# Altium schematic sheet Display.SchDoc
size A4; SheetNumber: 7; SheetTotal: 7
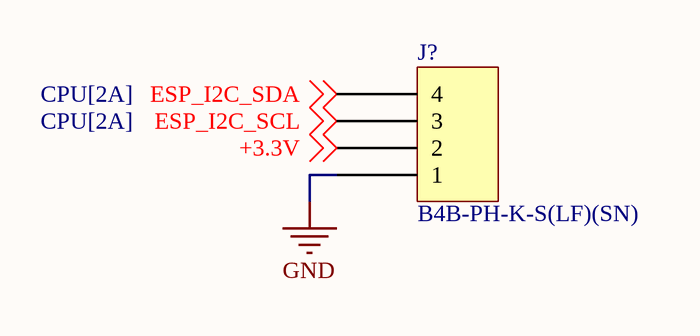
[diagram p0: Display.SchDoc]

## Parts
J?  B4B-PH-K-S(LF)(SN)  [JST B4B-PH-K]

## Nets
GND: J?.1
+3.3V: J?.2 ; off-sheet +3.3V
ESP_I2C_SCL: J?.3 ; off-sheet ESP_I2C_SCL
ESP_I2C_SDA: J?.4 ; off-sheet ESP_I2C_SDA

## Library data of the parts
J? = B4B-PH-K-S(LF)(SN): CONN HEADER VERT 4POS 2MM; Manufacturer: JST Sales America Inc.; Contact Length - Mating: 0.130" (3.30mm); Contact Length - Post: 0.134" (3.40mm); Current Rating (Amps): 2A; Material Flammability Rating: UL94 V-0; Number of Positions: 4; Number of Positions Loaded: All; Overall Contact Length: 0.333" (8.45mm); Pitch - Mating: 0.079" (2.00mm); Shrouding: Shrouded - 4 Wall; Style: Board to Cable/Wire; Voltage Rating: 100V; Part Number: B4B-PH-K-S(LF)(SN); ComponentLink1Description: Datasheet; ComponentLink1URL: http://www.jst-mfg.com/product/pdf/eng/ePH.pdf; ComponentLink2Description: DigiKey Link; ComponentLink2URL: http://digikey.com/product-detail/en/jst-sales-america-inc/B4B-PH-K-S-LF-SN/455-1706-ND/926613; Connector Type: Header; Contact Finish - Mating: Tin; Contact Finish - Post: Tin; Contact Material: Brass; Contact Shape: Square; Contact Type: Male Pin; Fastening Type: Detent Lock; Insulation Color: Natural; Insulation Height: 0.236" (6.00mm); Insulation Material: Polyamide (PA66), Nylon 6/6; LastUpdated: 12.01.2020 22:29:40; Lifecycle Status: Active; Minimum Order: 1; Mounting Type: Through Hole; Number of Rows: 1; Operating Temperature: -25°C ~ 85°C; Packaging: Bulk; PartId: 27; Part Status: Active; Price: 0.24; Series: PH; Supplier 1: DigiKey; Supplier Part Number 1: 455-1706-ND; Termination: Press-Fit, Solder